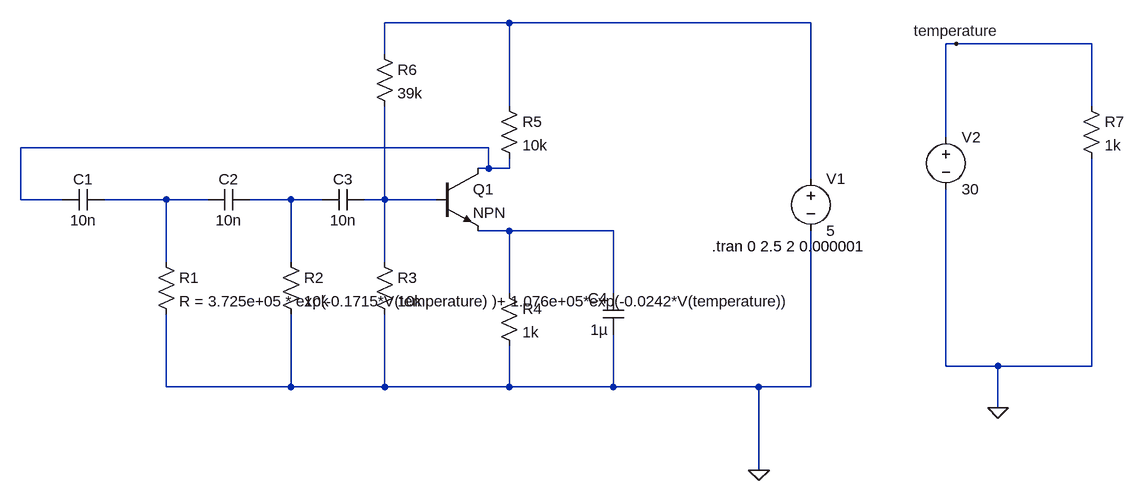
[diagram p0: schematic PhaseShiftOscillator_experiment.asc]
PhaseShiftOscillator_experiment.asc, the LTspice schematic file:
Version 4
SHEET 1 2880 680
WIRE 112 -64 -80 -64
WIRE 576 -64 112 -64
WIRE 800 -32 784 -32
WIRE 1008 -32 800 -32
WIRE -80 -16 -80 -64
WIRE 112 64 112 -64
WIRE 1008 64 1008 -32
WIRE 784 112 784 -32
WIRE 80 128 -640 128
WIRE 80 160 80 128
WIRE 80 160 64 160
WIRE 112 160 112 144
WIRE 112 160 80 160
WIRE 576 176 576 -64
WIRE -640 208 -640 128
WIRE -576 208 -640 208
WIRE -416 208 -512 208
WIRE -352 208 -416 208
WIRE -224 208 -288 208
WIRE -176 208 -224 208
WIRE -80 208 -80 64
WIRE -80 208 -112 208
WIRE 0 208 -80 208
WIRE 112 256 64 256
WIRE 272 256 112 256
WIRE -416 304 -416 208
WIRE -224 304 -224 208
WIRE -80 304 -80 208
WIRE 112 352 112 256
WIRE 272 352 272 256
WIRE 784 464 784 192
WIRE 864 464 784 464
WIRE 1008 464 1008 144
WIRE 1008 464 864 464
WIRE -416 496 -416 384
WIRE -224 496 -224 384
WIRE -224 496 -416 496
WIRE -80 496 -80 384
WIRE -80 496 -224 496
WIRE 112 496 112 432
WIRE 112 496 -80 496
WIRE 272 496 272 416
WIRE 272 496 112 496
WIRE 496 496 272 496
WIRE 576 496 576 256
WIRE 576 496 496 496
WIRE 864 528 864 464
WIRE 496 624 496 496
FLAG 496 624 0
FLAG 864 528 0
FLAG 800 -32 temperature
SYMBOL res -432 288 R0
SYMATTR InstName R1
SYMATTR Value R = 3.725e+05 * exp(-0.1715*V(temperature) )+ 1.076e+05*exp(-0.0242*V(temperature))
SYMBOL res -240 288 R0
SYMATTR InstName R2
SYMATTR Value 10k
SYMBOL res -96 288 R0
SYMATTR InstName R3
SYMATTR Value 10k
SYMBOL res 96 336 R0
SYMATTR InstName R4
SYMATTR Value 1k
SYMBOL res 96 48 R0
SYMATTR InstName R5
SYMATTR Value 10k
SYMBOL cap -512 192 R90
WINDOW 0 0 32 VBottom 2
WINDOW 3 32 32 VTop 2
SYMATTR InstName C1
SYMATTR Value 10n
SYMBOL cap -288 192 R90
WINDOW 0 0 32 VBottom 2
WINDOW 3 32 32 VTop 2
SYMATTR InstName C2
SYMATTR Value 10n
SYMBOL cap -112 192 R90
WINDOW 0 0 32 VBottom 2
WINDOW 3 32 32 VTop 2
SYMATTR InstName C3
SYMATTR Value 10n
SYMBOL cap 288 416 R180
WINDOW 0 24 56 Left 2
WINDOW 3 24 8 Left 2
SYMATTR InstName C4
SYMATTR Value 1µ
SYMBOL npn 0 160 R0
SYMATTR InstName Q1
SYMBOL res -96 -32 R0
SYMATTR InstName R6
SYMATTR Value 39k
SYMBOL voltage 576 160 R0
SYMATTR InstName V1
SYMATTR Value 5
SYMBOL voltage 784 96 R0
SYMATTR InstName V2
SYMATTR Value 30
SYMBOL res 992 48 R0
SYMATTR InstName R7
SYMATTR Value 1k
TEXT 424 280 Left 2 !.tran 0 2.5 2 0.000001

The netlist it stands for:
* PhaseShiftOscillator_experiment.asc
R1 N003 0 R = 3.725e+05 * exp(-0.1715*V(temperature) )+ 1.076e+05*exp(-0.0242*V(temperature))
R2 N004 0 10k
R3 N005 0 10k
R4 N006 0 1k
R5 N001 N002 10k
C1 N003 N002 10n
C2 N004 N003 10n
C3 N005 N004 10n
C4 0 N006 1µ
Q1 N002 N005 N006 0 NPN
R6 N001 N005 39k
V1 N001 0 5
V2 temperature 0 30
R7 temperature 0 1k
.model NPN NPN
.model PNP PNP
.lib standard.bjt
.tran 0 2.5 2 0.000001
.backanno
.end